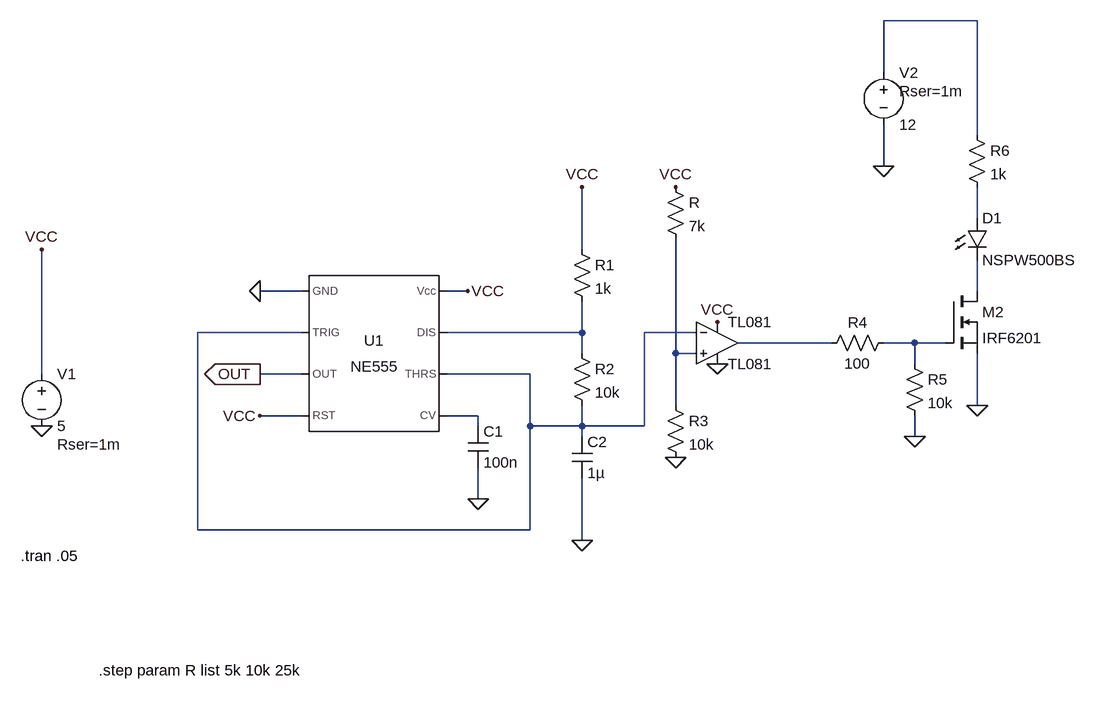
[diagram p0: schematic doniczka_lt_symulacja.asc]
doniczka_lt_symulacja.asc, the LTspice schematic file:
Version 4
SHEET 1 1292 680
WIRE 1136 -336 992 -336
WIRE 992 -256 992 -336
WIRE 1136 -160 1136 -336
WIRE 992 -112 992 -176
WIRE 1136 -32 1136 -80
WIRE 528 16 528 -80
WIRE 96 80 32 80
WIRE 352 80 320 80
WIRE 1136 80 1136 32
WIRE 96 144 -64 144
WIRE 528 144 528 96
WIRE 528 144 320 144
WIRE 704 144 624 144
WIRE 912 160 768 160
WIRE 1040 160 992 160
WIRE 1088 160 1040 160
WIRE 528 176 528 144
WIRE 672 176 672 0
WIRE 704 176 672 176
WIRE 1040 192 1040 160
WIRE -304 208 -304 16
WIRE 96 208 32 208
WIRE 448 208 320 208
WIRE 672 256 672 176
WIRE 1136 256 1136 176
WIRE 96 272 32 272
WIRE 368 272 320 272
WIRE 368 288 368 272
WIRE 448 288 448 208
WIRE 528 288 528 256
WIRE 528 288 448 288
WIRE 624 288 624 144
WIRE 624 288 528 288
WIRE 528 304 528 288
WIRE 1040 304 1040 272
WIRE 368 400 368 352
WIRE -64 448 -64 144
WIRE 448 448 448 288
WIRE 448 448 -64 448
WIRE 528 464 528 368
FLAG -304 288 0
FLAG 32 80 0
FLAG -304 16 VCC
FLAG 352 80 VCC
FLAG 32 272 VCC
FLAG 368 400 0
FLAG 32 208 OUT
IOPIN 32 208 Out
FLAG 528 464 0
FLAG 528 -80 VCC
FLAG 736 128 VCC
FLAG 736 192 0
FLAG 672 336 0
FLAG 672 -80 VCC
FLAG 1136 256 0
FLAG 1040 304 0
FLAG 992 -112 0
SYMBOL Misc\\NE555 208 176 R0
SYMATTR InstName U1
SYMBOL voltage -304 192 R0
WINDOW 123 0 0 Left 0
WINDOW 39 24 124 Left 2
SYMATTR SpiceLine Rser=1m
SYMATTR InstName V1
SYMATTR Value 5
SYMBOL cap 352 288 R0
SYMATTR InstName C1
SYMATTR Value 100n
SYMBOL res 512 0 R0
SYMATTR InstName R1
SYMATTR Value 1k
SYMBOL res 512 160 R0
SYMATTR InstName R2
SYMATTR Value 10k
SYMBOL cap 512 304 R0
SYMATTR InstName C2
SYMATTR Value 1µ
SYMBOL res 656 240 R0
SYMATTR InstName R3
SYMATTR Value 10k
SYMBOL res 656 -96 R0
SYMATTR InstName R
SYMATTR Value 7k
SYMBOL res 1008 144 R90
WINDOW 0 0 56 VBottom 2
WINDOW 3 32 56 VTop 2
SYMATTR InstName R4
SYMATTR Value 100
SYMBOL res 1024 176 R0
SYMATTR InstName R5
SYMATTR Value 10k
SYMBOL LED 1120 -32 R0
SYMATTR InstName D1
SYMATTR Value NSPW500BS
SYMBOL res 1120 -176 R0
SYMATTR InstName R6
SYMATTR Value 1k
SYMBOL voltage 992 -272 R0
WINDOW 123 0 0 Left 0
WINDOW 39 24 44 Left 2
SYMATTR SpiceLine Rser=1m
SYMATTR InstName V2
SYMATTR Value 12
SYMBOL nmos 1088 80 R0
SYMATTR InstName M2
SYMATTR Value IRF6201
SYMBOL TL081 736 160 R0
SYMATTR InstName TL081
TEXT -336 488 Left 2 !.tran .05
TEXT -216 664 Left 2 !.step param R list 5k 10k 25k

The netlist it stands for:
* doniczka_lt_symulacja.asc
XU1 0 N004 OUT VCC N009 N004 N005 VCC NE555  ; pins GND TRIG OUT RST CV THRS DIS Vcc
V1 VCC 0 5 Rser=1m
C1 N009 0 100n
R1 VCC N005 1k
R2 N005 N004 10k
C2 N004 0 1µ
R3 N008 0 10k
R VCC N008 7k
R4 N007 N006 100
R5 N007 0 10k
D1 N002 N003 NSPW500BS
R6 N001 N002 1k
V2 N001 0 12 Rser=1m
M2 N003 N007 0 0 IRF6201
* TL081: TL081 (symbol TL081 not available, pins judged from their places): In+=N008 In-=N004 V+=VCC V-=0 OUT=N006
.model D D
.lib standard.dio
.model NMOS NMOS
.model PMOS PMOS
.lib standard.mos
.tran .05
.step param R list 5k 10k 25k
.lib NE555.sub
.backanno
.end